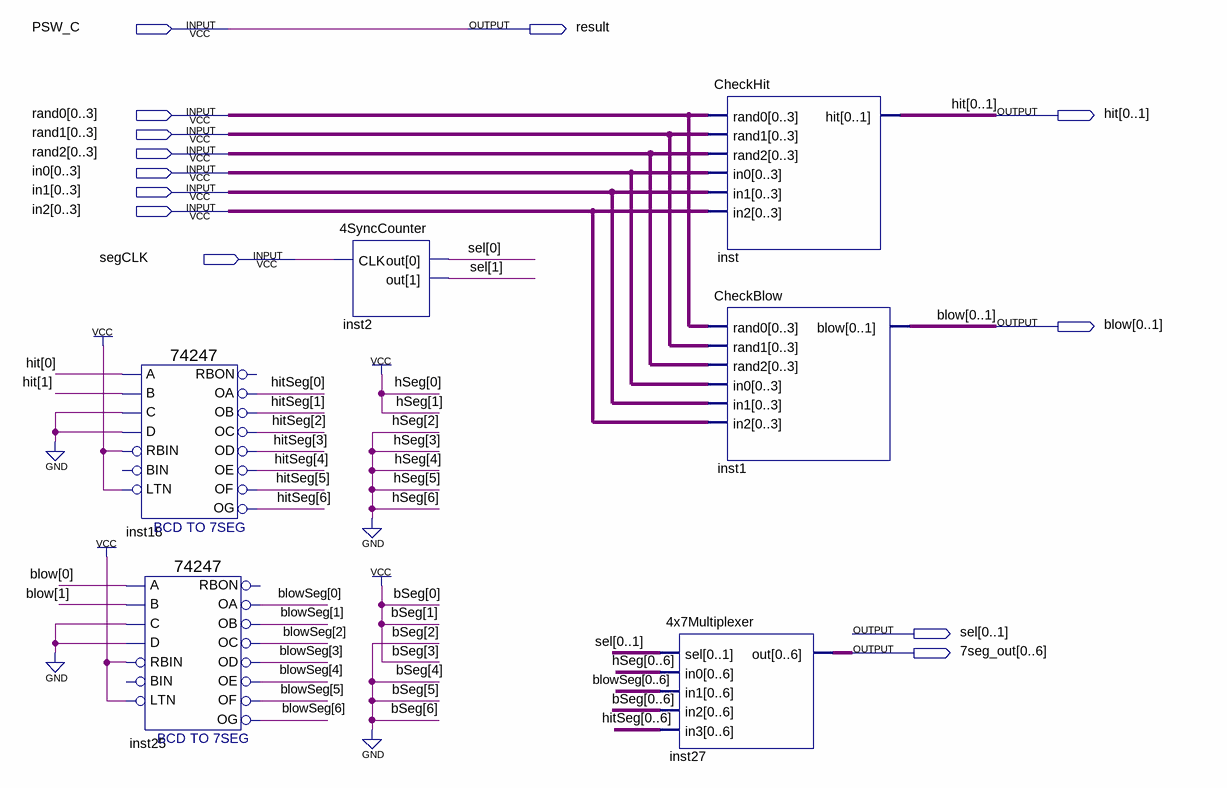
[diagram p0: schematic sheet]
// Quartus schematic CheckHitAndBlow.bdf as structural Verilog: 6 symbols, 13 pins
module CheckHitAndBlow (
  input  PSW_C,
  input  [0:3] rand0,
  input  [0:3] rand1,
  input  [0:3] rand2,
  input  [0:3] in0,
  input  [0:3] in1,
  input  [0:3] in2,
  input  segCLK,
  output result,
  output [0:1] hit,
  output [0:1] blow,
  output [0:1] sel,
  output [0:6] \7seg_out 
);

  wire [6:0] blowSeg, hitSeg;

  \74247  inst18 (
    .LTN(1'b1), .A(hit[0]), .B(hit[1]), .RBIN(1'b1), .C(1'b0), .D(1'b0), .OF(hitSeg[5]), .OC(hitSeg[2]),
    .OD(hitSeg[3]), .OE(hitSeg[4]), .OA(hitSeg[0]), .OB(hitSeg[1]), .OG(hitSeg[6]));  // open: BIN, RBON
  \74247  inst25 (
    .LTN(1'b1), .A(blow[0]), .B(blow[1]), .RBIN(1'b1), .C(1'b0), .D(1'b0), .OF(blowSeg[5]), .OC(blowSeg[2]),
    .OD(blowSeg[3]), .OE(blowSeg[4]), .OA(blowSeg[0]), .OB(blowSeg[1]), .OG(blowSeg[6]));  // open: BIN, RBON
  \4SyncCounter  inst2 (.CLK(segCLK), .out({sel[1], sel[0]}));
  CheckHit inst (.rand0(rand0), .rand1(rand1), .rand2(rand2), .in0(in0), .in1(in1), .in2(in2), .hit(hit));
  CheckBlow inst1 (.rand0(rand0), .rand1(rand1), .rand2(rand2), .in0(in0), .in1(in1), .in2(in2), .blow(blow));
  \4x7Multiplexer  inst27 (
    .sel(sel), .in0(7'b1100000),
    .in1({blowSeg[0], blowSeg[1], blowSeg[2], blowSeg[3], blowSeg[4], blowSeg[5], blowSeg[6]}),
    .in2(7'b1101000), .in3({hitSeg[0], hitSeg[1], hitSeg[2], hitSeg[3], hitSeg[4], hitSeg[5], hitSeg[6]}),
    .out(\7seg_out ));

  assign result = PSW_C;
endmodule
